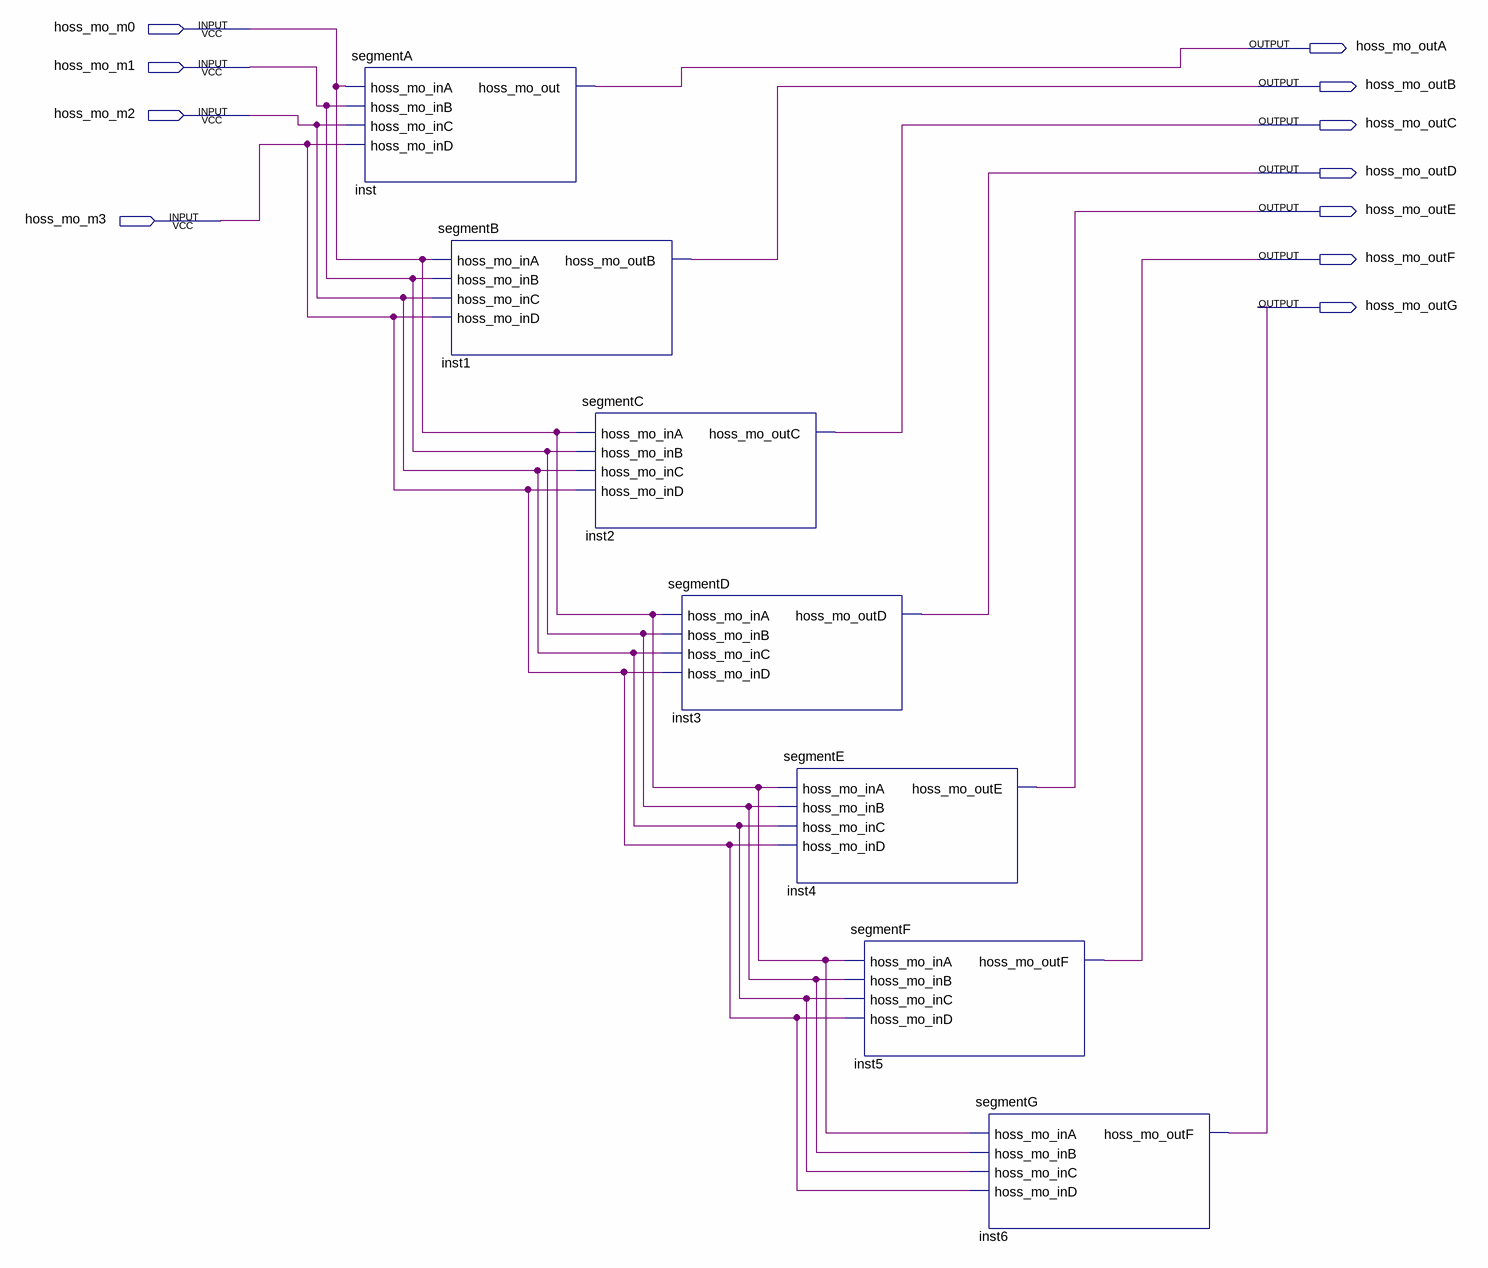
[diagram p0: schematic sheet]
// Quartus schematic sevenSegment.bdf as structural Verilog: 7 symbols, 11 pins
module sevenSegment (
  input  hoss_mo_m0,
  input  hoss_mo_m1,
  input  hoss_mo_m2,
  input  hoss_mo_m3,
  output hoss_mo_outA,
  output hoss_mo_outB,
  output hoss_mo_outC,
  output hoss_mo_outD,
  output hoss_mo_outE,
  output hoss_mo_outF,
  output hoss_mo_outG
);

  segmentA inst (
    .hoss_mo_inA(hoss_mo_m0), .hoss_mo_inB(hoss_mo_m1), .hoss_mo_inC(hoss_mo_m2), .hoss_mo_inD(hoss_mo_m3),
    .hoss_mo_out(hoss_mo_outA));
  segmentB inst1 (
    .hoss_mo_inA(hoss_mo_m0), .hoss_mo_inB(hoss_mo_m1), .hoss_mo_inC(hoss_mo_m2), .hoss_mo_inD(hoss_mo_m3),
    .hoss_mo_outB(hoss_mo_outB));
  segmentC inst2 (
    .hoss_mo_inA(hoss_mo_m0), .hoss_mo_inB(hoss_mo_m1), .hoss_mo_inC(hoss_mo_m2), .hoss_mo_inD(hoss_mo_m3),
    .hoss_mo_outC(hoss_mo_outC));
  segmentD inst3 (
    .hoss_mo_inA(hoss_mo_m0), .hoss_mo_inB(hoss_mo_m1), .hoss_mo_inC(hoss_mo_m2), .hoss_mo_inD(hoss_mo_m3),
    .hoss_mo_outD(hoss_mo_outD));
  segmentE inst4 (
    .hoss_mo_inA(hoss_mo_m0), .hoss_mo_inB(hoss_mo_m1), .hoss_mo_inC(hoss_mo_m2), .hoss_mo_inD(hoss_mo_m3),
    .hoss_mo_outE(hoss_mo_outE));
  segmentF inst5 (
    .hoss_mo_inA(hoss_mo_m0), .hoss_mo_inB(hoss_mo_m1), .hoss_mo_inC(hoss_mo_m2), .hoss_mo_inD(hoss_mo_m3),
    .hoss_mo_outF(hoss_mo_outF));
  segmentG inst6 (
    .hoss_mo_inA(hoss_mo_m0), .hoss_mo_inB(hoss_mo_m1), .hoss_mo_inC(hoss_mo_m2), .hoss_mo_inD(hoss_mo_m3),
    .hoss_mo_outF(hoss_mo_outG));
endmodule
